# EAGLE design zxdos_trainer (EAGLE 9.0.0)
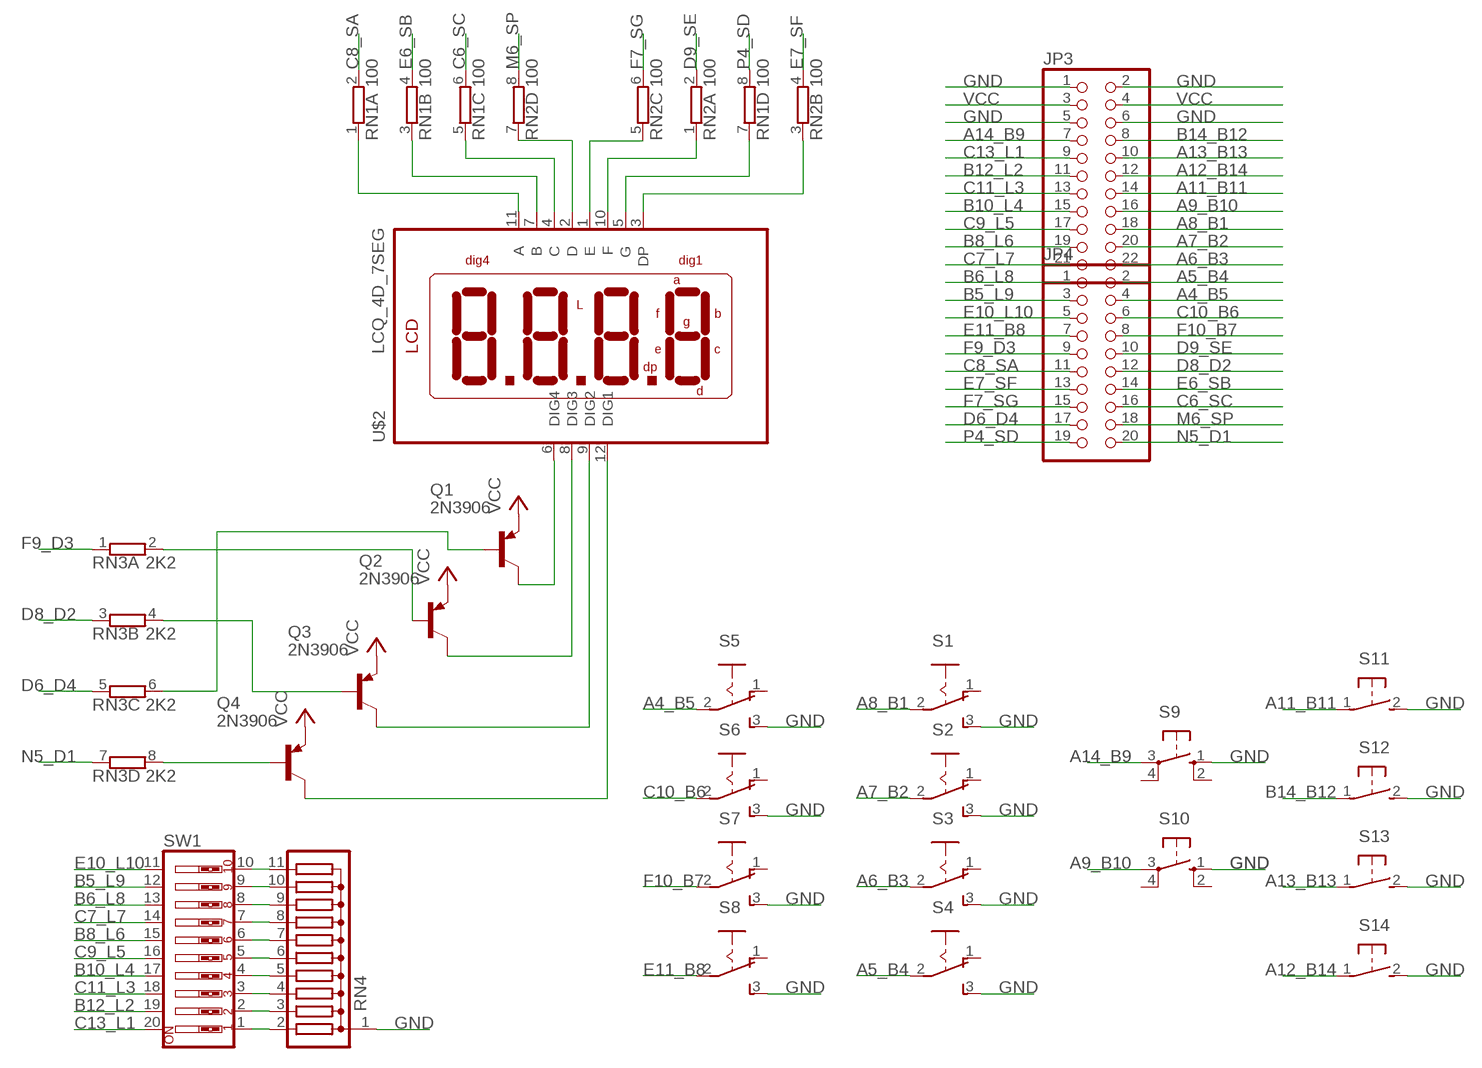
[diagram p0: schematic, sheet 1]

## Parts
JP3  PINHD-2X11  [2X11]
JP4  PINHD-2X10  [2X10]
Q1  2N3906  [TO92]
Q2  2N3906  [TO92]
Q3  2N3906  [TO92]
Q4  2N3906  [TO92]
RN1  100  E4R  [SIL8]
RN2  100  E4R  [SIL8]
RN3  2K2  E4R  [SIL8]
RN4  G10R  [SIL11]
S1  M251  [M251]
S2  M251  [M251]
S3  M251  [M251]
S4  M251  [M251]
S5  M251  [M251]
S6  M251  [M251]
S7  M251  [M251]
S8  M251  [M251]
S9  10-XX  [B3F-10XX]
S10  10-XX  [B3F-10XX]
S11  31-XX  [B3F-31XX]
S12  31-XX  [B3F-31XX]
S13  31-XX  [B3F-31XX]
S14  31-XX  [B3F-31XX]
SW1  SW_DIP-10  [EDG-10]
U$2  LCQ_4D_7SEG  [LDQ_4D_7SEG]

## Nets
A4_B5: JP4.4 S5.2(P)
A5_B4: JP4.2 S4.2(P)
A6_B3: JP3.22 S3.2(P)
A7_B2: JP3.20 S2.2(P)
A8_B1: JP3.18 S1.2(P)
A9_B10: JP3.16 S10.3(P)
A11_B11: JP3.14 S11.1(P)
A12_B14: JP3.12 S14.1(P)
A13_B13: JP3.10 S13.1(P)
A14_B9: JP3.7 S9.3(P)
B5_L9: JP4.3 SW1.12
B6_L8: JP4.1 SW1.13
B8_L6: JP3.19 SW1.15
B10_L4: JP3.15 SW1.17
B12_L2: JP3.11 SW1.19
B14_B12: JP3.8 S12.1(P)
C6_SC: JP4.16 RN1.6
C7_L7: JP3.21 SW1.14
C8_SA: JP4.11 RN1.2
C9_L5: JP3.17 SW1.16
C10_B6: JP4.6 S6.2(P)
C11_L3: JP3.13 SW1.18
C13_L1: JP3.9 SW1.20
D6_D4: JP4.17 RN3.5
D8_D2: JP4.12 RN3.3
D9_SE: JP4.10 RN2.2
E6_SB: JP4.14 RN1.4
E7_SF: JP4.13 RN2.4
E10_L10: JP4.5 SW1.11
E11_B8: JP4.7 S8.2(P)
F7_SG: JP4.15 RN2.6
F9_D3: JP4.9 RN3.1
F10_B7: JP4.8 S7.2(P)
GND [power]: JP3.1 JP3.2 JP3.5 JP3.6 RN4.1 S1.3(S) S2.3(S) S3.3(S) S4.3(S) S5.3(S) S6.3(S) S7.3(S) S8.3(S) S9.1(S) S10.1(S) S11.2(S) S12.2(S) S13.2(S) S14.2(S)
M6_SP: JP4.18 RN2.8
N5_D1: JP4.20 RN3.7
N$1: RN4.2 SW1.1
N$2: RN4.3 SW1.2
N$3: Q1.1(C) U$2.6(DIG4)
N$4: RN4.4 SW1.3
N$6: Q2.1(C) U$2.8(DIG3)
N$7: Q3.1(C) U$2.9(DIG2)
N$8: RN4.5 SW1.4
N$9: Q4.1(C) U$2.12(DIG1)
N$10: Q4.2(B) RN3.8
N$11: RN1.1 U$2.11(A)
N$12: RN1.3 U$2.7(B)
N$13: RN1.5 U$2.4(C)
N$14: RN2.7 U$2.2(D)
N$15: RN2.5 U$2.1(E)
N$16: RN2.1 U$2.10(F)
N$17: Q2.2(B) RN3.2
N$18: RN2.3 U$2.3(DP)
N$19: Q1.2(B) RN3.6
N$20: RN1.7 U$2.5(G)
N$21: Q3.2(B) RN3.4
N$22: RN4.6 SW1.5
N$23: RN4.7 SW1.6
N$24: RN4.8 SW1.7
N$25: RN4.9 SW1.8
N$26: RN4.10 SW1.9
N$27: RN4.11 SW1.10
P4_SD: JP4.19 RN1.8
VCC: JP3.3 JP3.4 Q1.3(E) Q2.3(E) Q3.3(E) Q4.3(E)
Unconnected: S1.1(O) S2.1(O) S3.1(O) S4.1(O) S5.1(O) S6.1(O) S7.1(O) S8.1(O) S9.2(S1) S9.4(P1) S10.2(S1) S10.4(P1)

## Library data of the parts
JP3 = pinhead:PINHD-2X11: PIN HEADER
JP4 = pinhead:PINHD-2X10: PIN HEADER
Q1-Q4 = transistor-pnp:2N3906: PNP Transistor
RN1-RN3 = resistor-sil:E4R: SIL RESISTOR; OC_FARNELL: unknown; OC_NEWARK: unknown
RN4 = resistor-sil:G10R: SIL RESISTOR; OC_FARNELL: unknown; OC_NEWARK: unknown
S1-S8 = switch:M251: SLIDING SWITCH Mors, distributor Buerklin, 11G702
S9 S10 = switch-omron:10-XX: OMRON SWITCH; MPN: B3F-1000; OC_FARNELL: 176432; OC_NEWARK: 36M3542
S11-S14 = switch-omron:31-XX: OMRON SWITCH; MPN: B3F-3100; OC_FARNELL: 959704; OC_NEWARK: 36M3582
SW1 = special:SW_DIP-10: DIP SWITCH
U$2 = mylib:LCQ_4D_7SEG

## Net classes
0 default: width 0.178 mm, clearance 0.178 mm
1 power: width 0.305 mm, clearance 0.178 mm to class 0, clearance 0.229 mm

## Board
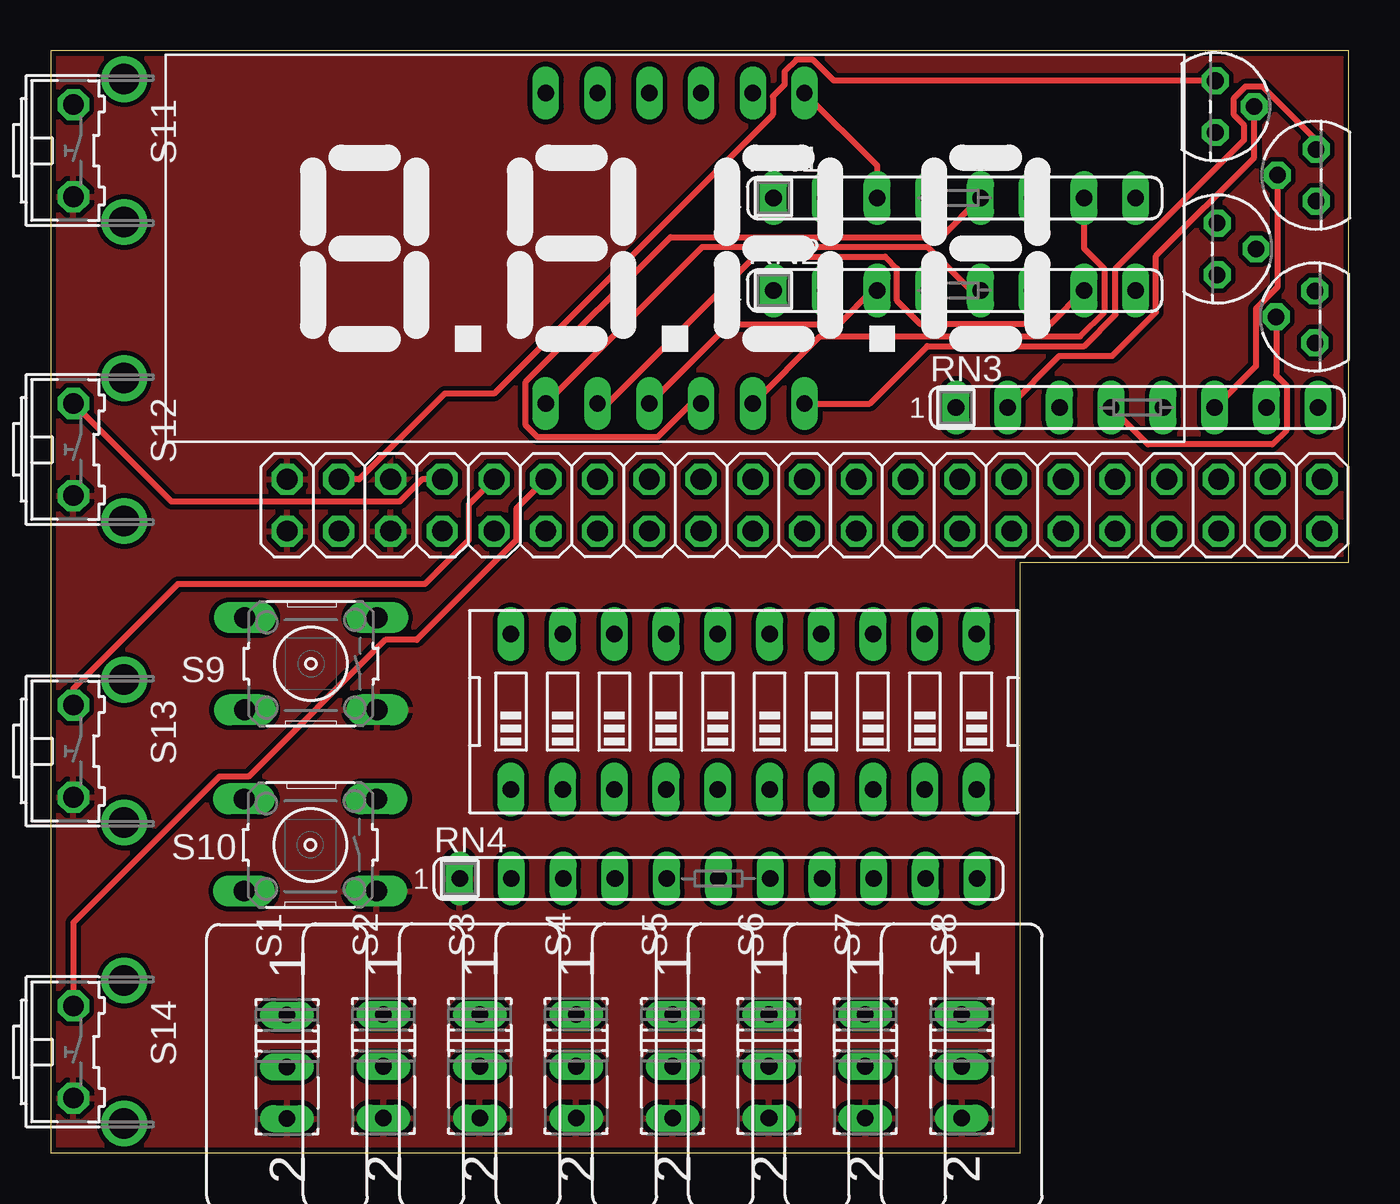
[diagram p1: board, top side]
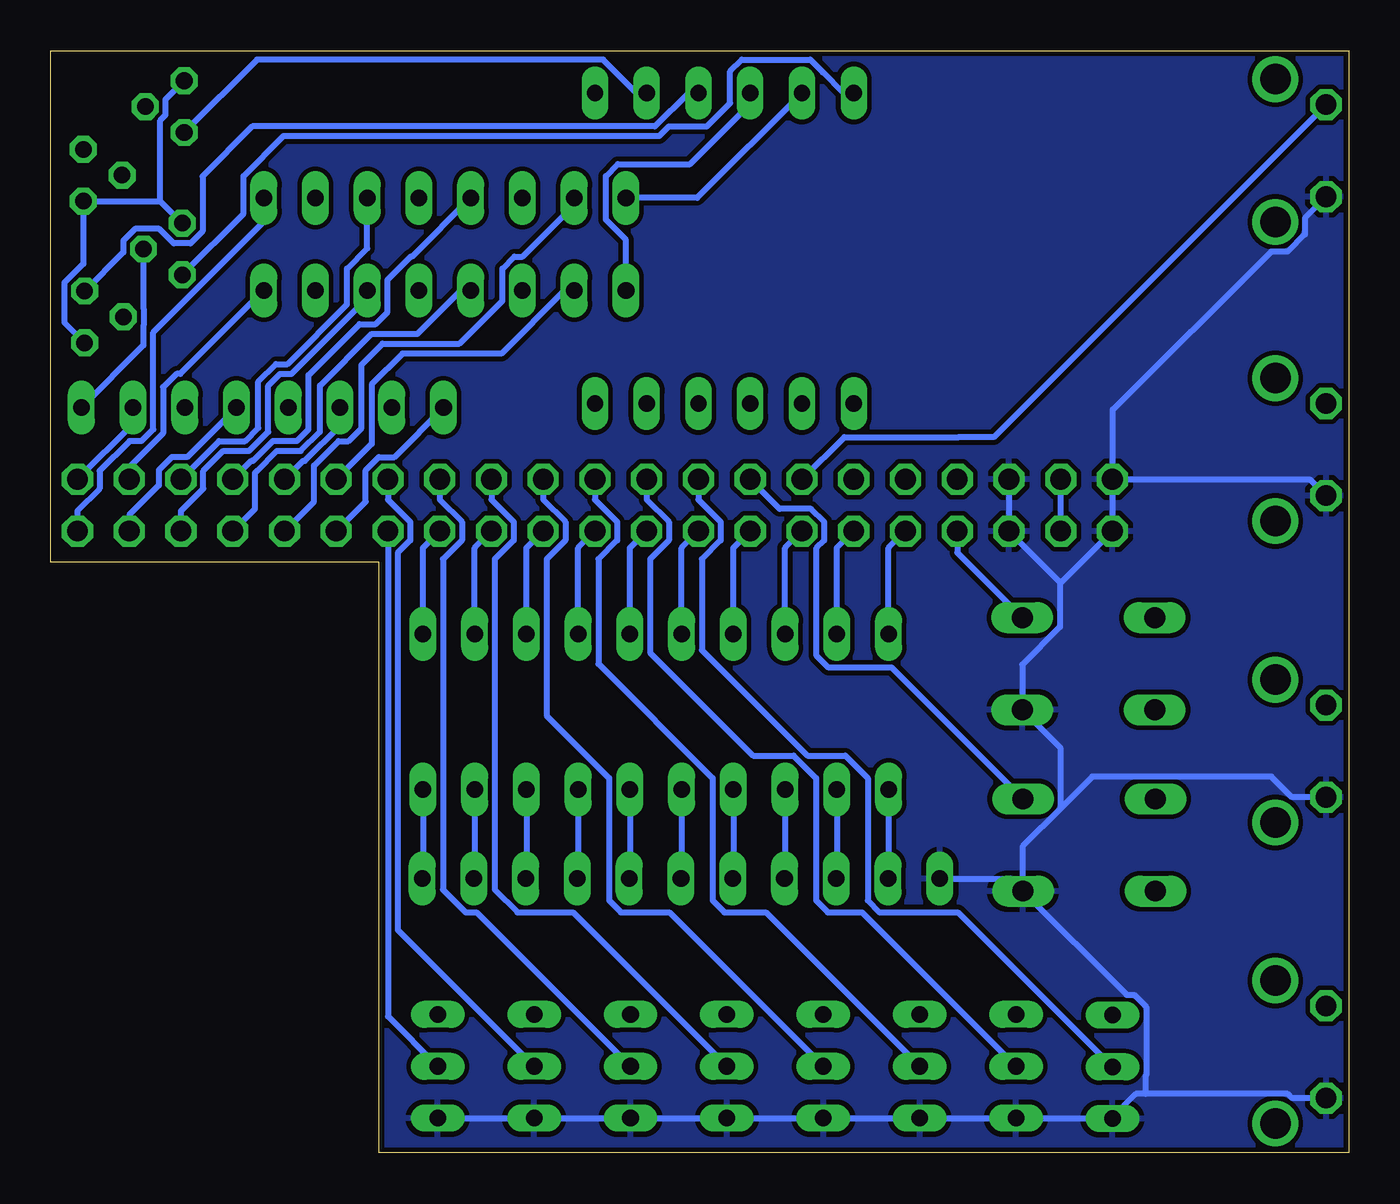
[diagram p2: board, bottom side, seen from below]

Size 63.69 x 54.07 mm. Coordinates in mm from the lower left corner, seen from the top.
Outline: 63.69,28.99 63.69,54.07 0,54.07 0,0 47.59,0 47.59,28.99 63.69,28.99
Copper layers (1*16): Top 0.035mm / dielectric 1.5mm / Bottom 0.035mm
Design rules "seedstudio_Fusion_eagle_rule_v1.1": minimum track width 6mil, minimum drill 12mil, track to track 6mil, track to pad 6mil, pad to pad 6mil, via to via 6mil, smd to smd 0mil, copper to edge 10mil, drill to drill 10mil, minimum pad ring 10mil, minimum via ring 6mil, stop-mask expansion 2mil, vias tented up to drill 100mil, thermal gap 10mil

### Footprints (pad centres in the part's own frame; a part is rotated, then mirrored left to right if it is on the bottom)
2X11 = drill 1.016 octagon: 1 -12.7,-1.27; 2 -12.7,1.27; 3 -10.16,-1.27; 4 -10.16,1.27; 5 -7.62,-1.27; 6 -7.62,1.27; 7 -5.08,-1.27; 8 -5.08,1.27; 9 -2.54,-1.27; 10 -2.54,1.27; 11 0,-1.27; 12 0,1.27; 13 2.54,-1.27; 14 2.54,1.27; 15 5.08,-1.27; 16 5.08,1.27; 17 7.62,-1.27; 18 7.62,1.27; 19 10.16,-1.27; 20 10.16,1.27; 21 12.7,-1.27; 22 12.7,1.27
2X10 = drill 1.016 octagon: 1 -11.43,-1.27; 2 -11.43,1.27; 3 -8.89,-1.27; 4 -8.89,1.27; 5 -6.35,-1.27; 6 -6.35,1.27; 7 -3.81,-1.27; 8 -3.81,1.27; 9 -1.27,-1.27; 10 -1.27,1.27; 11 1.27,-1.27; 12 1.27,1.27; 13 3.81,-1.27; 14 3.81,1.27; 15 6.35,-1.27; 16 6.35,1.27; 17 8.89,-1.27; 18 8.89,1.27; 19 11.43,-1.27; 20 11.43,1.27
TO92 = drill 0.813 octagon: 1 1.27,0; 2 0,1.905; 3 -1.27,0
SIL8 = drill 0.813 long: 1 -8.89,0; 2 -6.35,0; 3 -3.81,0; 4 -1.27,0; 5 1.27,0; 6 3.81,0; 7 6.35,0; 8 8.89,0
SIL11 = drill 0.813 long: 1 -12.7,0; 2 -10.16,0; 3 -7.62,0; 4 -5.08,0; 5 -2.54,0; 6 0,0; 7 2.54,0; 8 5.08,0; 9 7.62,0; 10 10.16,0; 11 12.7,0
M251 = drill 0.813 long: 1 -2.54,0; 2 0,0; 3 2.54,0
B3F-10XX = drill 1.016 long: 1 -3.251,2.261; 2 3.251,2.261; 3 -3.251,-2.261; 4 3.251,-2.261
B3F-31XX = drill 1.016 octagon: 1 -2.261,-1.245; 2 2.261,-1.245 | drill 1.499 pad 2.159: 3 -3.505,1.245; 4 3.505,1.245
EDG-10 = drill 0.813 long: 1 -11.43,-3.81; 2 -8.89,-3.81; 3 -6.35,-3.81; 4 -3.81,-3.81; 5 -1.27,-3.81; 6 1.27,-3.81; 7 3.81,-3.81; 8 6.35,-3.81; 9 8.89,-3.81; 10 11.43,-3.81; 11 11.43,3.81; 12 8.89,3.81; 13 6.35,3.81; 14 3.81,3.81; 15 1.27,3.81; 16 -1.27,3.81; 17 -3.81,3.81; 18 -6.35,3.81; 19 -8.89,3.81; 20 -11.43,3.81
LDQ_4D_7SEG = drill 0.8 long: 1 -6.35,-7.62; 2 -3.81,-7.62; 3 -1.27,-7.62; 4 1.27,-7.62; 5 3.81,-7.62; 6 6.35,-7.62; 7 6.35,7.62; 8 3.81,7.62; 9 1.27,7.62; 10 -1.27,7.62; 11 -3.81,7.62; 12 -6.35,7.62

### Placement (x,y rotation side)
JP3  24.29,31.78 0 top
JP4  50.96,31.78 0 top
Q1  62.1,47.97 90 top
Q2  57.15,51.34 270 top
Q3  62.04,41.02 90 top
Q4  57.25,44.35 270 top
RN1  44.35,46.86 0 top
RN2  44.35,42.32 0 top
RN3  53.31,36.58 0 top
RN4  32.77,13.46 0 top
S1  11.59,4.22 270 top
S2  16.32,4.25 270 top
S3  21.05,4.25 270 top
S4  25.78,4.25 270 top
S5  30.51,4.25 270 top
S6  35.24,4.25 270 top
S7  39.97,4.25 270 top
S8  44.7,4.25 270 top
S9  12.76,24 180 top
S10  12.73,15.11 180 top
S11  2.35,49.18 270 top
S12  2.35,34.51 270 top
S13  2.35,19.72 270 top
S14  2.35,4.95 270 top
SW1  34,21.65 0 top
U$2  30.64,44.39 0 top

### Tracks (layer width: path | path; a pad name or v marks a point on that pad's centre or on a via)
A4_B5
  Bottom 0.305: S5.2 38.07,11.81 40.8,11.81 41.9,12.92 41.9,29.13 40.98,30.06 40.98,30.96 42.07,32.06 JP4.4
A5_B4
  Bottom 0.305: JP4.2 39.53,32.06 38.44,30.96 38.44,30.06 39.36,29.13 39.36,21.45 36.3,18.39 36.3,12.39 35.72,11.81 33.34,11.81 S4.2
A6_B3
  Bottom 0.305: JP3.22 36.99,32.06 35.9,30.96 35.9,30.06 36.82,29.13 36.82,23.99 31.22,18.39 31.22,12.39 30.64,11.81 28.61,11.81 S3.2
A7_B2
  Bottom 0.305: JP3.20 34.45,32.06 33.36,30.96 33.36,30.06 34.28,29.13 34.28,24.55 29.22,19.49 27.24,19.49 26.14,18.39 26.14,12.39 25.56,11.81 23.88,11.81 S2.2
A8_B1
  Bottom 0.305: JP3.18 31.91,32.06 30.82,30.96 30.82,30.06 31.74,29.13 31.74,24.68 26.56,19.49 24.7,19.49 23.6,18.39 23.6,12.39 23.02,11.81 19.18,11.81 S1.2
A9_B10
  Bottom 0.305: S10.3 22.42,23.81 25.52,23.81 26.11,24.39 26.11,29.69 25.74,30.06 25.74,30.96 26.38,31.6 27.92,31.6 JP3.16
A11_B11
  Bottom 0.305: JP3.14 24.75,35.13 19.14,35.13 19.13,35.13 17.42,35.13 S11.1
A12_B14
  Top 0.305: JP3.12 22.84,31.6 22.84,30.06 17.95,25.17 16.41,25.17 9.7,18.47 8.27,18.47 1.1,11.3 S14.1
A13_B13
  Top 0.305: JP3.10 20.51,31.81 20.51,30.07 18.35,27.91 6.22,27.91 1.1,22.79 S13.1
A14_B9
  Bottom 0.305: JP3.7 19.21,29.46 S9.3
B5_L9
  Bottom 0.305: SW1.12 42.89,29.69 JP4.3
B6_L8
  Bottom 0.305: SW1.13 40.35,29.69 JP4.1
B8_L6
  Bottom 0.305: SW1.15 35.27,29.69 JP3.19
B10_L4
  Bottom 0.305: SW1.17 30.19,29.69 JP3.15
B12_L2
  Bottom 0.305: SW1.19 25.11,29.69 JP3.11
B14_B12
  Top 0.305: JP3.8 18.21,33.05 17.12,31.96 5.92,31.96 S12.1
C6_SC
  Bottom 0.305: JP4.16 55.44,34.93 54.17,34.93 53.51,35.58 53.51,37.85 52.65,38.71 52.08,38.71 49.16,41.63 49.16,43.39 48.16,44.38 RN1.6
C7_L7
  Bottom 0.305: SW1.14 37.81,29.69 JP3.21
C8_SA
  Bottom 0.305: JP4.11 50.78,31.96 50.78,33.72 49.58,34.93 49.09,34.93 48.45,35.56 48.45,38.67 47.41,39.71 43.64,39.71 41.54,41.81 41.54,43.39 40.96,43.97 40.53,43.97 38.01,46.5 RN1.2
C9_L5
  Bottom 0.305: SW1.16 32.73,29.69 JP3.17
C10_B6
  Bottom 0.305: S6.2 42.8,11.81 43.34,11.81 44.44,12.92 44.44,29.13 43.52,30.06 43.52,30.96 44.61,32.06 JP4.6
C11_L3
  Bottom 0.305: SW1.18 27.65,29.69 JP3.13
C13_L1
  Bottom 0.305: SW1.20 22.57,29.69 JP3.9
D6_D4
  Bottom 0.305: JP4.17 59.85,31.31 58.4,32.75 58.4,33.5 57.76,34.14 57.01,34.14 RN3.5
D8_D2
  Bottom 0.305: JP4.12 51.32,33.96 51.23,33.96 49.5,35.69 RN3.3
D9_SE
  Bottom 0.305: JP4.10 47.95,34.79 47.95,37.71 46.44,39.22 41.58,39.22 38.48,42.32 RN2.2
E6_SB
  Bottom 0.305: RN1.4 45.97,43.97 46.04,43.97 47.17,42.83 47.17,41.25 47.75,40.67 48.55,40.67 51.05,38.17 51.05,35.51 51.63,34.93 52.8,34.93 53.77,33.96 53.86,33.96 JP4.14
E7_SF
  Bottom 0.305: JP4.13 53.68,31.6 53.68,33.37 53.57,33.48 52.6,34.44 51.43,34.44 50.49,35.38 50.49,37.65 47.95,40.19 45.7,40.19 43.56,42.32 43.12,42.32 RN2.4
E10_L10
  Bottom 0.305: SW1.11 45.43,29.69 JP4.5
E11_B8
  Bottom 0.305: JP4.7 47.15,6.7 S8.2
F7_SG
  Bottom 0.305: RN2.6 48.16,41.94 51.88,38.23 52.45,38.23 53.03,37.65 53.03,35.38 53.97,34.44 55.24,34.44 56.22,33.46 56.22,32.6 57.31,31.51 JP4.15
F9_D3
  Bottom 0.305: JP4.9 48.24,31.96 48.24,33.5 47.6,34.14 46.83,34.14 44.42,36.56 RN3.1
F10_B7
  Bottom 0.305: S7.2 46.67,10.95 46.67,29.45 46.06,30.06 46.06,30.96 47.15,32.06 JP4.8
GND
  Bottom 0.305: RN4.1 16.59,13.46 S10.1 | S10.1 15.98,15.07 14.13,16.92 | 14.13,16.92 14.13,19.86 S9.1 16.02,23.96 14.16,25.81 14.16,28 | 14.16,28 JP3.5 JP3.6 | JP3.2 JP3.1 14.1,28 14.16,28 | S8.3 S7.3 S6.3 S5.3 S4.3 S3.3 | 20.48,1.59 20.61,1.71 S3.3 | S3.3 S2.3 11.62,1.71 | 11.62,1.71 S1.3 | S14.2 2.78,2.69 2.99,2.9 9.97,2.9 | 9.97,2.9 10.43,2.9 11.62,1.71 | S10.1 10.88,7.75 10.52,7.75 9.94,7.17 9.94,3.81 9.97,3.78 9.97,2.9 | S13.2 2.78,17.46 3.79,18.47 12.58,18.47 14.13,16.92 | JP3.2 1.91,33.05 S12.2 | 11.59,36.47 11.59,36.44 | JP3.2 11.59,36.35 11.59,36.44 | S11.2 2.14,45.89 2.14,45.07 2.99,44.22 3.8,44.22 11.59,36.44
  pour Top: -0.92,55.05 64.13,55.05 64.13,-0.32 -1.11,-0.32
  pour Bottom: -0.92,55.05 64.13,55.05 64.13,-0.32 -1.11,-0.32
M6_SP
  Bottom 0.305: RN2.8 57.34,38.23 57.53,38.23 58.19,37.57 58.19,35.31 59.85,33.64 JP4.18
N5_D1
  Bottom 0.305: JP4.20 59.66,35.78 RN3.7
N$1
  Bottom 0.305: SW1.1 22.57,13.49 RN4.2
N$2
  Bottom 0.305: SW1.2 25.11,13.49 RN4.3
N$3
  Top 0.305: U$2.6 40.2,36.77 43.02,39.59 50.71,39.59 52.25,41.13 52.25,43.39 58.57,49.71 58.57,50.42 58.06,50.93 58.06,51.75 58.65,52.33 59.47,52.33 62.1,49.69 Q1.1
N$4
  Bottom 0.305: SW1.3 27.65,13.49 RN4.4
N$6
  Bottom 0.305: U$2.8 34.94,52.01 36.58,53.64 53.58,53.64 Q2.1
N$7
  Bottom 0.305: Q3.1 60.14,44.19 60.14,44.77 59.56,45.35 58.37,45.35 57.66,44.63 56.84,44.63 56.26,45.21 56.26,47.92 53.8,50.37 34.04,50.37 32.4,52.01 U$2.9
N$8
  Bottom 0.305: SW1.4 30.19,13.49 RN4.5
N$9
  Bottom 0.305: 56.74,43.59 Q4.1 54.23,46.09 54.23,47.93 52.28,49.89 33.84,49.89 33.36,50.37 31.5,50.37 30.35,51.52 30.35,53.07 29.78,53.64 26.42,53.64 25.92,53.14 25.8,53.02 | 25.8,53.02 25.78,53.02 | U$2.12 24.78,52.01 25.8,53.02
N$10
  Bottom 0.305: RN3.8 59.15,39.62 59.15,40.6 59.14,40.61 59.14,41.43 59.15,41.44 Q4.2
N$11
  Bottom 0.305: U$2.11 31.97,46.86 RN1.1
N$12
  Top 0.305: U$2.7 40.55,48.45 RN1.3
N$13
  Top 0.305: U$2.4 31.41,36.77 29.78,35.13 23.88,35.13 23.3,35.71 23.3,37.83 30.41,44.94 43.7,44.94 RN1.5
N$14
  Top 0.305: U$2.2 27.32,36.77 34.53,43.97 40.96,43.97 41.54,43.39 41.54,41.81 42.67,40.67 49.05,40.67 RN2.7
N$15
  Top 0.305: RN2.5 45.15,42.32 43.01,44.46 31.98,44.46 U$2.1
N$16
  Bottom 0.305: RN2.1 35.47,44.8 36.46,45.79 36.46,47.93 35.88,48.51 32.32,48.51 29.37,51.47 U$2.10
N$17
  Top 0.305: RN3.2 49.49,39.1 52.09,39.1 54.23,41.25 54.23,44.02 59.05,48.84 Q2.2
N$18
  Top 0.305: U$2.3 33.27,40.67 38.67,40.67 40.32,42.32 | 40.07,42.32 40.32,42.32 | 40.32,42.32 RN2.3
N$19
  Top 0.305: Q1.2 60.2,42.49 59.14,41.43 59.14,38.6 RN3.6
N$20
  Top 0.305: 34.94,36.77 U$2.5 37.75,40.07 50.51,40.07 51.7,41.25 51.7,43.39 50.71,44.38 RN1.7
N$21
  Top 0.305: Q3.2 60.14,38.16 60.65,37.65 60.65,35.47 59.94,34.77 53.85,34.77 RN3.4
  Bottom 0.305: 52.54,36.58 RN3.4
N$22
  Bottom 0.305: SW1.5 32.73,13.49 RN4.6
N$23
  Bottom 0.305: SW1.6 35.27,13.49 RN4.7
N$24
  Bottom 0.305: SW1.7 37.81,13.49 RN4.8
N$25
  Bottom 0.305: SW1.8 40.35,13.49 RN4.9
N$26
  Bottom 0.305: SW1.9 42.89,13.49 RN4.10
N$27
  Bottom 0.305: SW1.10 45.43,13.49 RN4.11
P4_SD
  Bottom 0.305: JP4.19 62.39,31.51 61.3,32.6 61.3,33.46 59.83,34.93 59.25,34.93 58.67,35.51 58.67,40.26 53.25,45.68 RN1.8
VCC
  Top 0.305: Q2.3 38.43,52.61 37.4,53.64 36.58,53.64 36.01,53.07 36.01,52.42 35.43,51.85 35.43,50.95 21.74,37.26 19.33,37.26 15.12,33.05 JP3.4
  Bottom 0.305: Q3.3 63.03,40.74 63.03,42.7 62.1,43.63 Q1.3 58.33,46.7 | 58.33,46.7 Q4.3 | 58.33,46.7 58.33,50.67 58.06,50.93 58.06,51.7 Q2.3 | JP3.3 JP3.4